# Altium project touch_key.PrjPcb
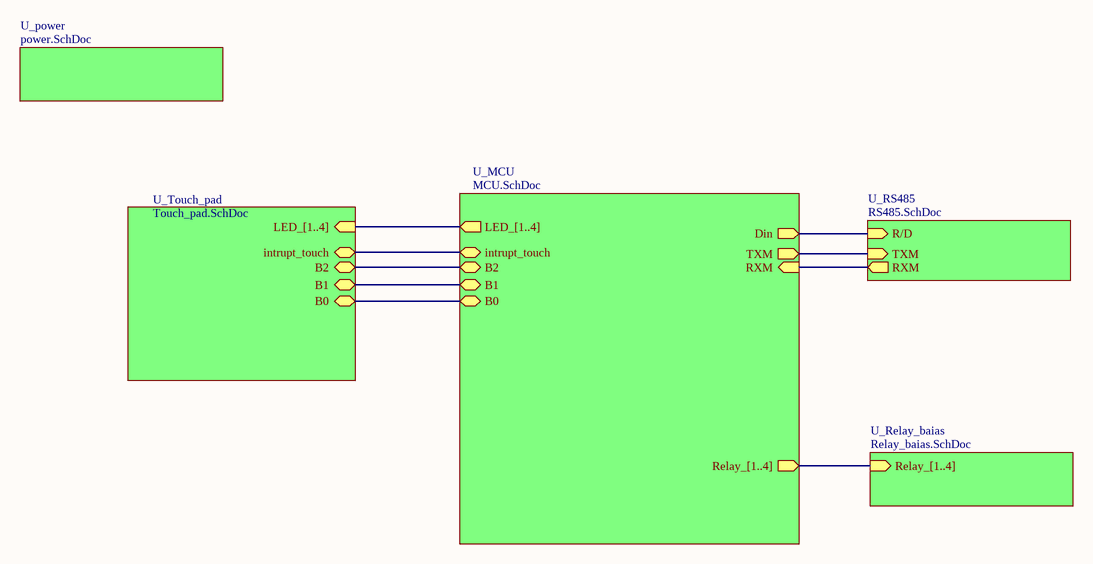
[diagram p0: Top.SchDoc]
6 sheets, 60 parts. Net scope: hierarchical (ports join the sheet entries above them; power ports are global).
Board file: touch_key_v0.1.PcbDoc
Sheets:
  Top.SchDoc
    U_MCU = MCU.SchDoc
    U_RS485 = RS485.SchDoc
    U_Touch_pad = Touch_pad.SchDoc
    U_Relay_baias = Relay_baias.SchDoc
    U_power = power.SchDoc

## Sheet Top.SchDoc
size A4; SheetNumber: 1; SheetTotal: 6

### Sub-sheets
U_MCU = MCU.SchDoc: LED_[1..4] (out), Din (out), Relay_[1..4] (out), B1 (bidir), B0 (bidir), B2 (bidir), TXM (out), RXM (in), intrupt_touch (bidir)
U_power = power.SchDoc: no entries
U_Relay_baias = Relay_baias.SchDoc: Relay_[1..4] (in)
U_RS485 = RS485.SchDoc: TXM (in), R/D (in), RXM (out)
U_Touch_pad = Touch_pad.SchDoc: LED_[1..4] (in), B2 (bidir), B0 (bidir), B1 (bidir), intrupt_touch (bidir)

### Nets
B0: sheet U_MCU/B0, sheet U_Touch_pad/B0
B1: sheet U_MCU/B1, sheet U_Touch_pad/B1
B2: sheet U_MCU/B2, sheet U_Touch_pad/B2
Din: sheet U_MCU/Din, sheet U_RS485/R/D
intrupt_touch: sheet U_MCU/intrupt_touch, sheet U_Touch_pad/intrupt_touch
RX: sheet U_MCU/RXM, sheet U_RS485/RXM
TX: sheet U_MCU/TXM, sheet U_RS485/TXM

### Buses and harness runs
bus sheet U_MCU/LED_[1..4] = sheet U_Touch_pad/LED_[1..4]
bus sheet U_MCU/Relay_[1..4] = sheet U_Relay_baias/Relay_[1..4]

## Sheet MCU.SchDoc
size A4; SheetNumber: 2; SheetTotal: 6
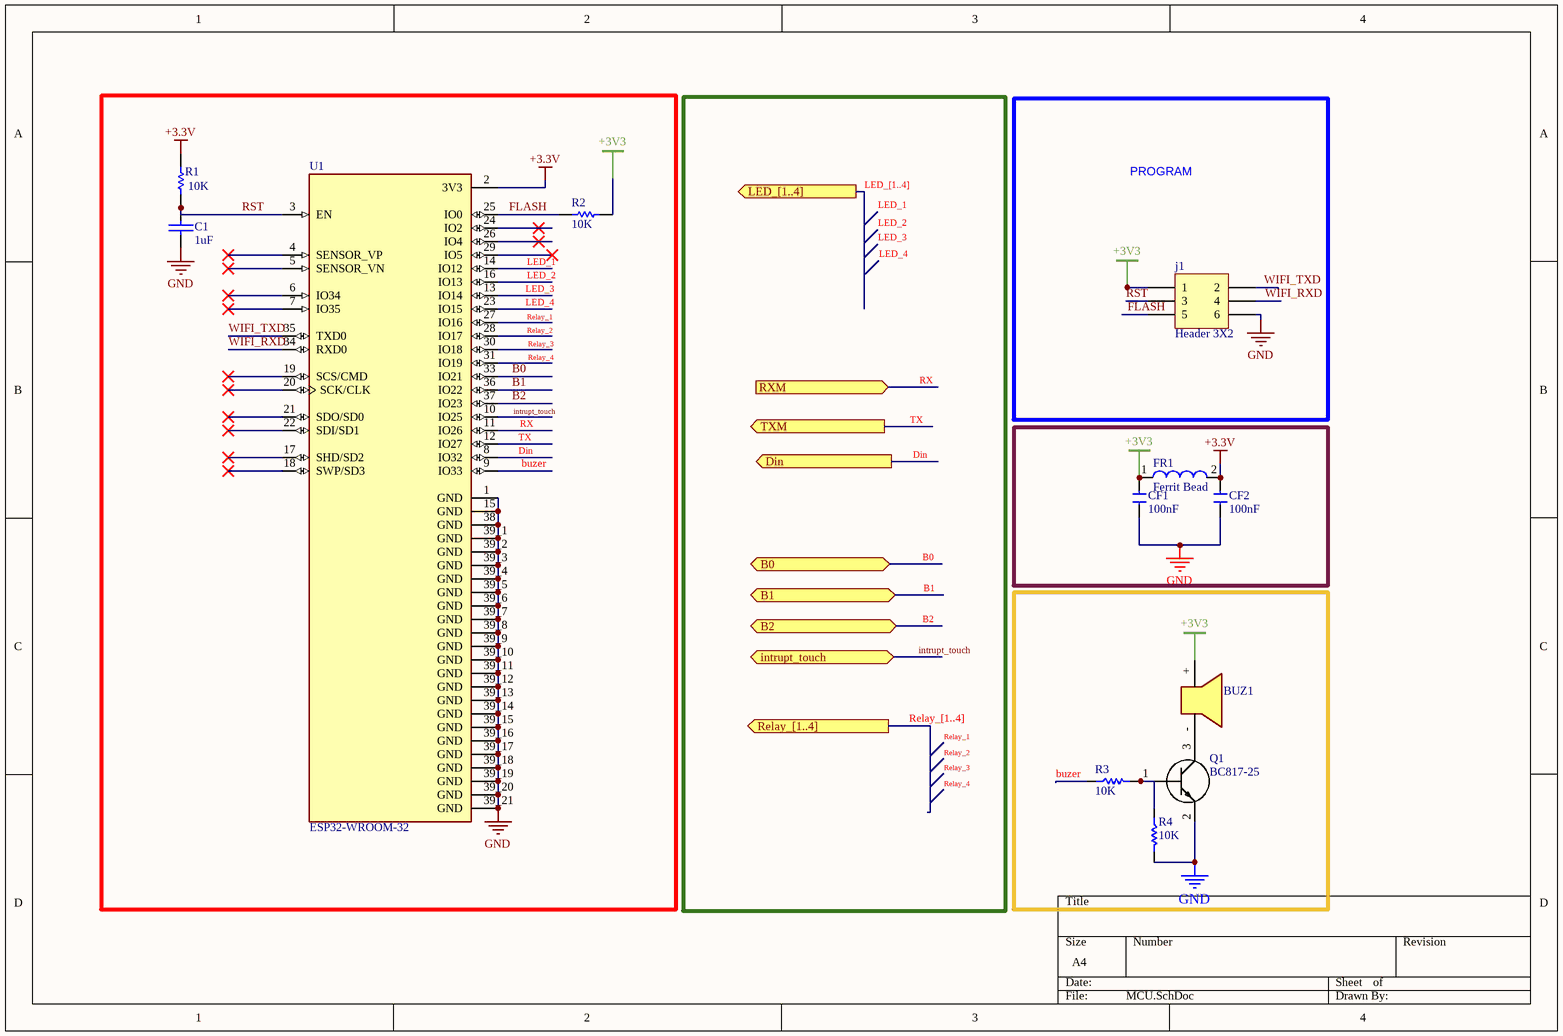
[diagram p1: MCU.SchDoc]

### Parts
(Parts that share a designator on the sheet are numbered #1, #2 ... from top to bottom, then left to right.)
BUZ1  Buzzer  [Buzzer_japan]  (value not drawn)
C1  1uF  [RES 0603 (1608X06L)]
CF1  Capacitor SMD  [RES 0603 (1608X06L)]  (value not drawn)
CF2  Capacitor SMD  [RES 0603 (1608X06L)]  (value not drawn)
FR1  Ferrit Bead  [RES 0805 (2012X06L)]
j1#1  Header 3X2  [HDR2X3]
Q1  BC817-25  [BC81725215]
R1  10K  [RES 0603 (1608X06L)]
R2  10K  [RES 0603 (1608X06L)]
R3  10K  [RES 0603 (1608X06L)]
R4  10K  [RES 0603 (1608X06L)]
U1  ESP32-WROOM-32  [MODULE_ESP32-WROOM-32]

### Blocks framed on the sheet
PROGRAM: j1#1

### Ports
B0 (bidir), B1 (bidir), B2 (bidir), Din (out), intrupt_touch (bidir), LED_[1..4] (out), Relay_[1..4] (out), RXM (in), TXM (out)

### Nets
+3.3V: CF2.1 FR1.2 R1.2 U1.2(3V3)
+3V3: BUZ1.+ CF1.1 FR1.1 j1#1.1 R2.1
GND: C1.1 CF1.2 CF2.2 j1#1.6 Q1.2(E) R4.2 U1.1(GND) U1.15(GND) U1.38(GND) U1.39_1(GND) U1.39_2(GND) U1.39_3(GND) U1.39_4(GND) U1.39_5(GND) U1.39_6(GND) U1.39_7(GND) U1.39_8(GND) U1.39_9(GND) U1.39_10(GND) U1.39_11(GND) U1.39_12(GND) U1.39_13(GND) U1.39_14(GND) U1.39_15(GND) U1.39_16(GND) U1.39_17(GND) U1.39_18(GND) U1.39_19(GND) U1.39_20(GND) U1.39_21(GND)
B0: U1.33(IO21) ; port B0
B1: U1.36(IO22) ; port B1
B2: U1.37(IO23) ; port B2
buzer: R3.1 U1.9(IO33)
Din: U1.8(IO32) ; port Din
FLASH: j1#1.5 R2.2 U1.25(IO0)
intrupt_touch: U1.10(IO25) ; port intrupt_touch
LED_1: U1.14(IO12)
LED_2: U1.16(IO13)
LED_3: U1.13(IO14)
LED_4: U1.23(IO15)
Relay_1: U1.27(IO16)
Relay_2: U1.28(IO17)
Relay_3: U1.30(IO18)
Relay_4: U1.31(IO19)
RST: C1.2 j1#1.3 R1.1 U1.3(EN)
RX: U1.11(IO26) ; port RXM
TX: U1.12(IO27) ; port TXM
WIFI_RXD: j1#1.4 U1.34(RXD0)
WIFI_TXD: j1#1.2 U1.35(TXD0)
NetBUZ1_-: BUZ1.- Q1.3(C)
NetQ1_1: Q1.1(B) R3.2 R4.1

Not connected (* = marked no-connect by the designer): U1 4(SENSOR_VP)* 5(SENSOR_VN)* 6(IO34)* 7(IO35)* 17(SHD/SD2)* 18(SWP/SD3)* 19(SCS/CMD)* 20(SCK/CLK)* 21(SDO/SD0)* 22(SDI/SD1)* 24(IO2)* 26(IO4)* 29(IO5)*

### Buses and harness runs
bus LED_[1..4] = port LED_[1..4]
bus Relay_[1..4] = port Relay_[1..4]

### Notes on the sheet
- Labels drawn without touching a wire or pin: LED_1, LED_2, LED_3, LED_4, Relay_1, Relay_2, Relay_3, Relay_4
- (in symbol Capacitor SMD) 100nF

### Library data of the parts
BUZ1 = Buzzer..: Buzzer/dip/12v; pin to pad: +>1 ->2; LatestRevisionDate: 17-Jul-2002; LatestRevisionNote: Re-released for DXP Platform.; Publisher: Altium Limited
C1 = CAP: Capacitor; Value: 1uF
j1#1 = Header 3X2: Header, 3-Pin, Dual row; LatestRevisionDate: 17-Jul-2002; LatestRevisionNote: Re-released for DXP Platform.; Publisher: Altium Limited
Q1 = BC817-25: Transistor BJT NPN; Manufacturer_Name: Nexperia; Datasheet Link: https://assets.nexperia.com/documents/data-sheet/BC817_BC817W_BC337.pdf; Height: 1.1mm; Manufacturer_Part_Number: BC817-25; Mouser Part Number: N/A; Mouser Price/Stock: https://www.mouser.com/Search/Refine.aspx?Keyword=N%2FA
R1 R2 = Res1: Resistor; Published: 8-Jun-2000; LatestRevisionDate: 17-Jul-2002; LatestRevisionNote: Re-released for DXP Platform.; PackageReference: AXIAL-0.3; Publisher: Altium Limited; Value: 10K
R3 R4 = Resistor: Tolerance: 5%; Power: 1/8 W; Value: 10K
U1 = ESP32-WROOM-32: Bluetooth, WiFi Transceiver Module 2.4GHz ~ 2.5GHz Surface Mount; MF: Espressif Systems; Package: Module Espressif Systems; Digi-Key_Part_Number: 1904-1010-1-ND; Digi-Key_Purchase_URL: https://www.digikey.com/product-detail/en/espressif-systems/ESP32-WROOM-32/1904-1010-1-ND/8544305?utm_source=snapeda&utm_medium=aggregator&utm_campaign=symbol; Value: *; MP: ESP32-WROOM-32; SnapEDA_Link: https://www.snapeda.com/parts/ESP32-WROOM-32/Espressif%20Systems/view-part/2753322/?ref=snap

## Sheet RS485.SchDoc
size A4; SheetNumber: 4; SheetTotal: 6
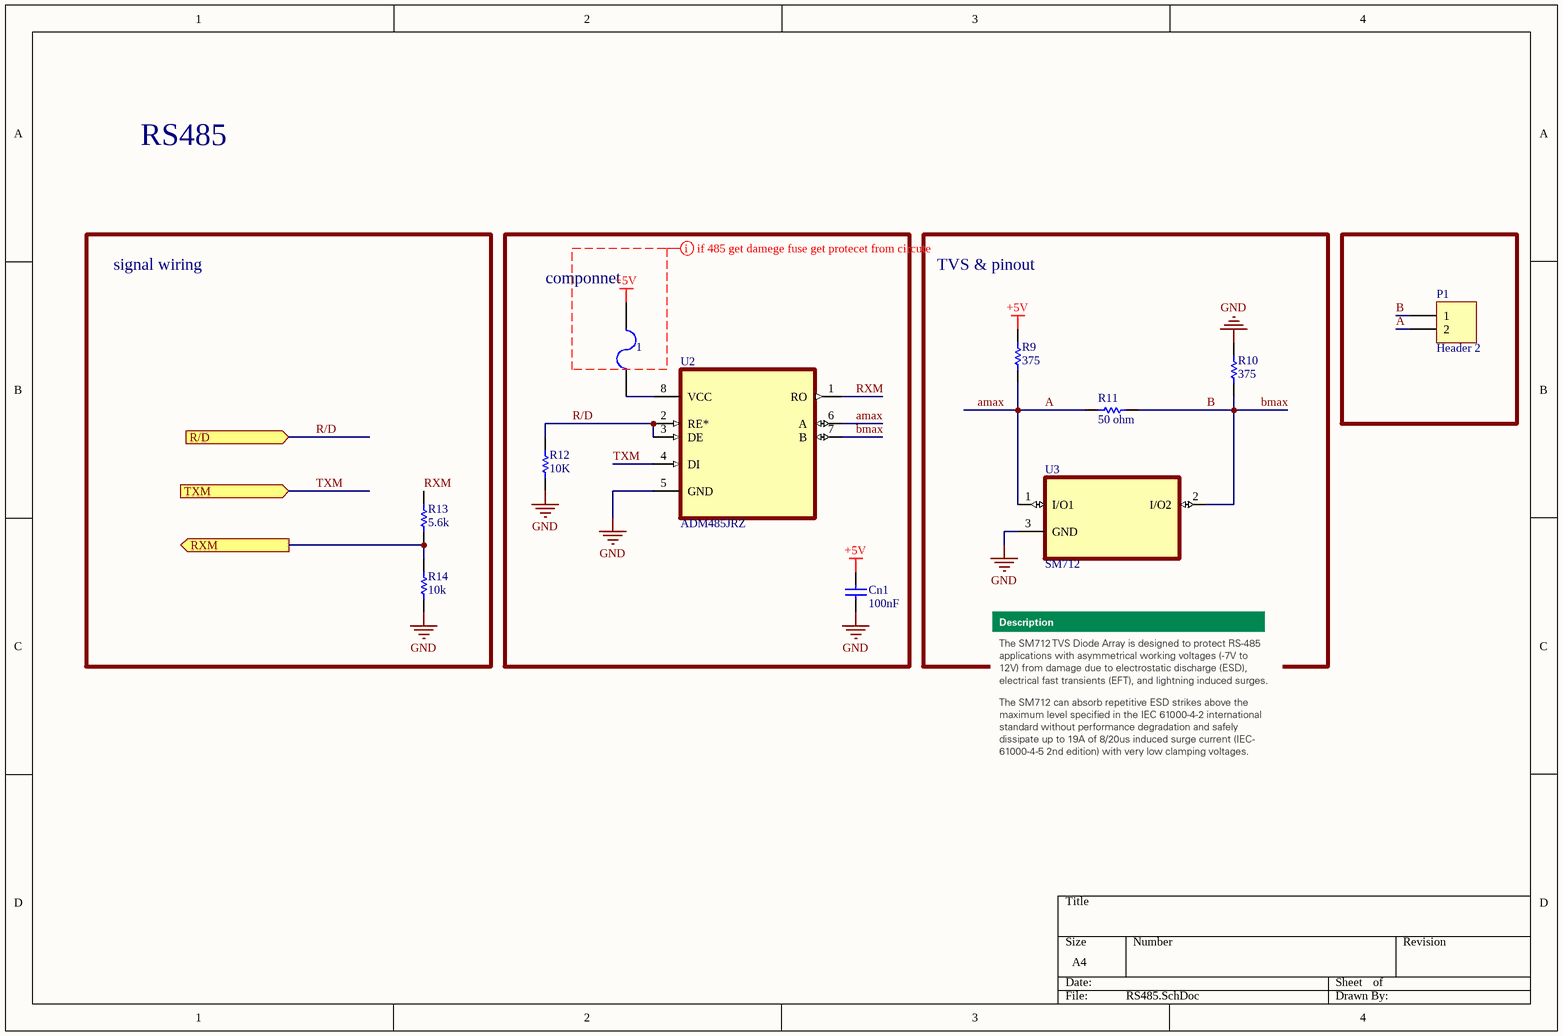
[diagram p2: RS485.SchDoc]

### Parts
1  F=1.0 A  [SMD_RES_0805]  (value not drawn)
Cn1  100nF  [RES 0603 (1608X06L)]
P1  Header 2  [HDR1X2]
R9  375  [RES 0603 (1608X06L)]
R10  375  [RES 0603 (1608X06L)]
R11  50 ohm  [RES 0603 (1608X06L)]
R12  10K  [RES 0603 (1608X06L)]
R13  5.6k  [RES 0603 (1608X06L)]
R14  10k  [RES 0603 (1608X06L)]
U2  ADM485JRZ  [SOIC127P600X175-8N]
U3  SM712  [SOT95P237X112-3N]

### Blocks framed on the sheet
signal wiring: R13 R14
componnet: 1 Cn1 R12 U2
TVS & pinout: R9-R11 U3

### Ports
R/D (in), RXM (out), TXM (in)

### Nets
+5V: 1.2 Cn1.2 R9.1
GND: Cn1.1 R10.1 R12.2 R14.2 U2.5(GND) U3.3(GND)
A: P1.2 R9.2 R11.1 U2.6(A) U3.1(I/O1)  [also labelled amax]
B: P1.1 R10.2 R11.2 U2.7(B) U3.2(I/O2)  [also labelled bmax]
R/D: R12.1 U2.2(RE*) U2.3(DE) ; port R/D  [project net Din]
RX: R13.2 R14.1 ; port RXM
RXM: R13.1 U2.1(RO)
TXM: U2.4(DI) ; port TXM  [project net TX]
Net1_1: 1.1 U2.8(VCC)

### Layout directives
mark named if 485 get damege fuse get protecet from circute: +5V

### Notes on the sheet
- RS485

### Library data of the parts
1 = Fuse SMD1206: SMD Fuses 1206; Designer: Abbas Basereh; Desc.: SMD Fuses 1206; Data: 16-12-2016
Cn1 = CAP SMD PACKAGE: TOTAL CAPACITOR SMD PACK; Designer: Abbas Basereh; Desc.: CAP SMD TOTAL PACKAGES; Data: 2017-3-10; VALUE: 100nF
P1 = Header 2: Header, 2-Pin; LatestRevisionDate: 17-Jul-2002; LatestRevisionNote: Re-released for DXP Platform.; Publisher: Altium Limited
R9-R14 = RES 0805 0.125W: RES 0805; Designer: Abbas Basereh; Desc.: RES SMD 0805; Data: 16-12-2016
U2 = ADM485JRZ: EIA RS-485 Transceiver; MF: {'manufacturer': u'Analog Devices'}; Price: None; Package: None; Availability: Unavailable; Value: *; MP: ADM485JRZ
U3 = SM712: TVS Diode; MF: {'manufacturer': u'Semtech'}; Availability: Unavailable; Value: *; Price: None; MP: SM712; Package: None

## Sheet Touch_pad.SchDoc
size A4; SheetNumber: 3; SheetTotal: 6
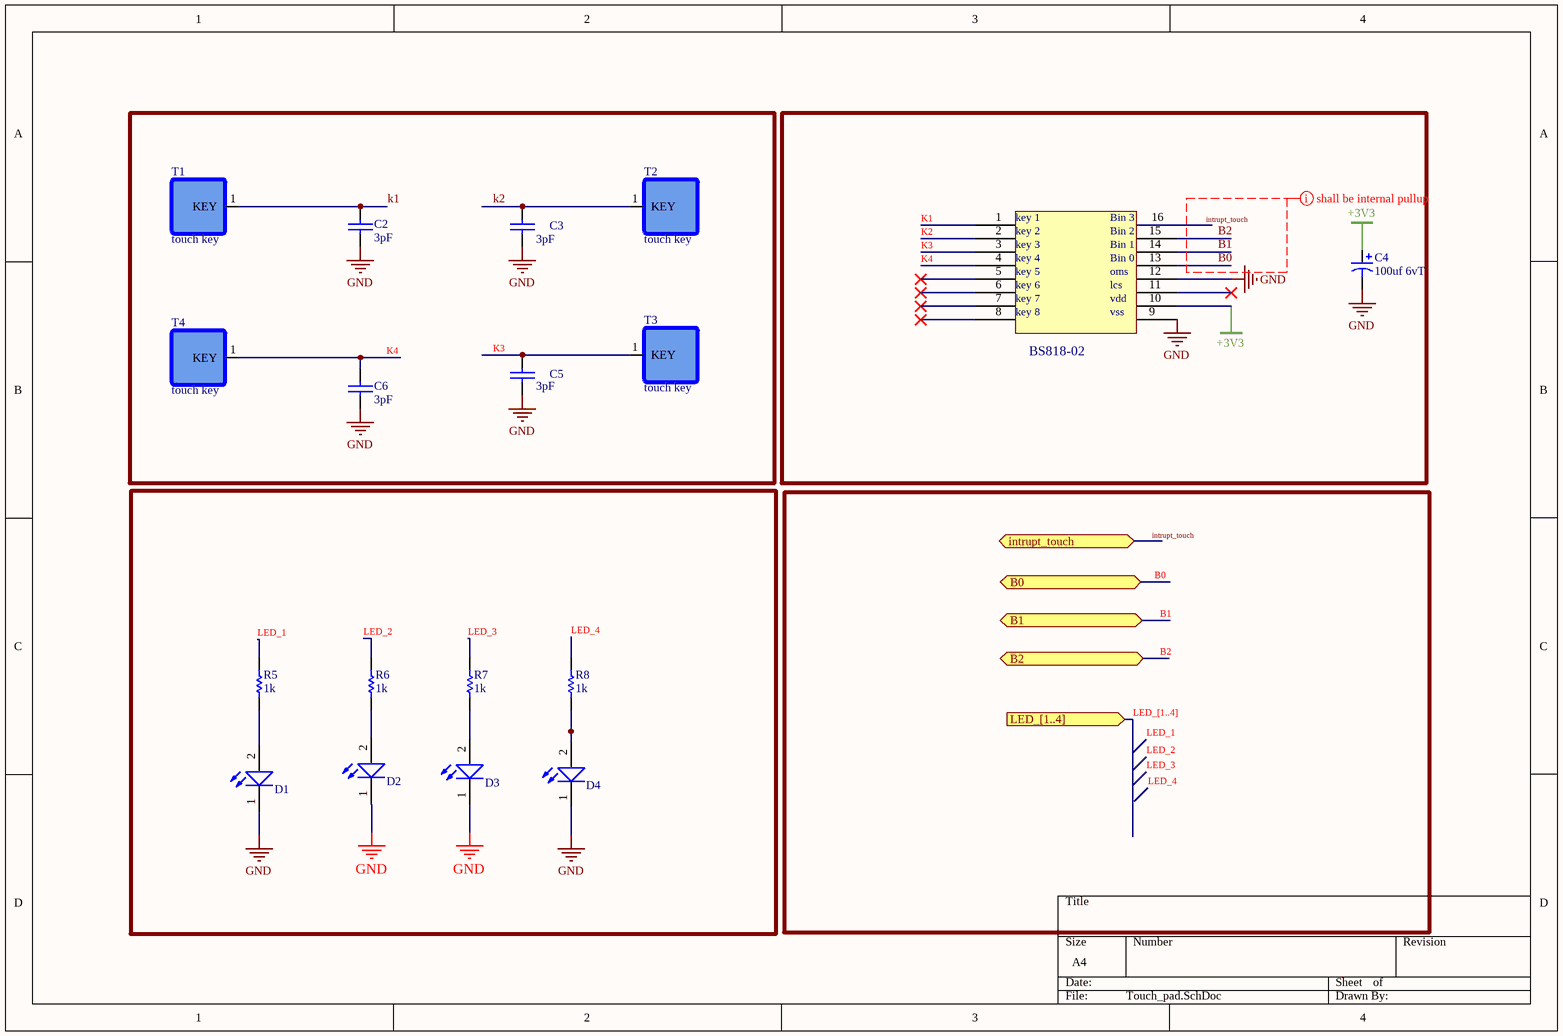
[diagram p3: Touch_pad.SchDoc]

### Parts
BS1  BS818-02  [SOIC127P600X175-16N]  (value not drawn)
C2  3pF  [RES 0603 (1608X06L)]
C3  3pF  [RES 0603 (1608X06L)]
C4  100uf 6vT  [B]
C5  3pF  [RES 0603 (1608X06L)]
C6  3pF  [RES 0603 (1608X06L)]
D1  LED SMD PACKAGE  [LED_SMD_0805]  (value not drawn)
D2  LED SMD PACKAGE  [LED_SMD_0805]  (value not drawn)
D3  LED SMD PACKAGE  [LED_SMD_0805]  (value not drawn)
D4  LED SMD PACKAGE  [LED_SMD_0805]  (value not drawn)
R5  1k  [RES 0603 (1608X06L)]
R6  1k  [RES 0603 (1608X06L)]
R7  1k  [RES 0603 (1608X06L)]
R8  1k  [RES 0603 (1608X06L)]
T1  touch key  [Touch_key]
T2  touch key  [Touch_key]
T3  touch key  [Touch_key]
T4  touch key  [Touch_key]

### Ports
B0 (bidir), B1 (bidir), B2 (bidir), intrupt_touch (bidir), LED_[1..4] (in)

### Nets
+3V3: BS1.10 C4.1
GND: BS1.9 BS1.12 C2.1 C3.1 C4.2 C5.1 C6.1 D1.1(K) D2.1(K) D3.1(K) D4.1(K)
B0: BS1.13 ; port B0
B1: BS1.14 ; port B1
B2: BS1.15 ; port B2
intrupt_touch: BS1.16 ; port intrupt_touch
k1: BS1.1 C2.2 T1.1(KEY)
K2: BS1.2 C3.2 T2.1(KEY)
K3: BS1.3 C5.2 T3.1(KEY)
K4: BS1.4 C6.2 T4.1(KEY)
LED_1: R5.1
LED_2: R6.1
LED_3: R7.1
LED_4: R8.1
NetD1_2: D1.2(A) R5.2
NetD2_2: D2.2(A) R6.2
NetD3_2: D3.2(A) R7.2
NetD4_2: D4.2(A) R8.2

Not connected (* = marked no-connect by the designer): BS1 5* 6* 7* 8* 11*

### Buses and harness runs
bus LED_[1..4] = port LED_[1..4]

### Layout directives
mark named shall be internal pullup: B0, B1, B2, intrupt_touch

### Notes on the sheet
- Labels drawn without touching a wire or pin: LED_1, LED_2, LED_3, LED_4
- (in symbol Component_1) key 1; Bin 3; key 2; Bin 2; key 3; Bin 1; key 4; Bin 0; key 5; oms; key 6; lcs; key 7; vdd; key 8; vss

### Library data of the parts
BS1 = Component_1
C2 C3 C5 C6 = CAP: Capacitor; Value: 3pF
C4 = T494B: Cap/Tantalum/SMD/B; Published: 17-Jul-2002; LatestRevisionDate: 19-Mar-2004; LatestRevisionNote: Silkscreen dimensions re-sized.; DatasheetDocument: Mar-2001; PackageDocument: Mar-2001; PackageReference: B; Publisher: Altium Limited; Code_JEITA: 3528-21; ComponentLink1Description: Manufacturer Link; ComponentLink1URL: http://www.kemet.com/; ComponentLink2Description: Datasheet; ComponentLink2URL: http://www.kemet.com/kemet/web/homepage/kechome.nsf/vapubfilesname/F3102TA.pdf/$file/F3102TA.pdf
D1-D4 = LED SMD PACKAGE: SMD Mono-color Chip LED Waterclear; Part Number: 150080BS75000; Peak Wavelength: 465 nm; Forward Voltage: 3.2 V; Published Date: Jan 2017; Publisher: Ali Hafizi
R5-R8 = Res1: Resistor; Published: 8-Jun-2000; LatestRevisionDate: 17-Jul-2002; LatestRevisionNote: Re-released for DXP Platform.; PackageReference: AXIAL-0.3; Publisher: Altium Limited; Value: 1k

## Sheet Relay_baias.SchDoc
size A; SheetNumber: 6; SheetTotal: 6
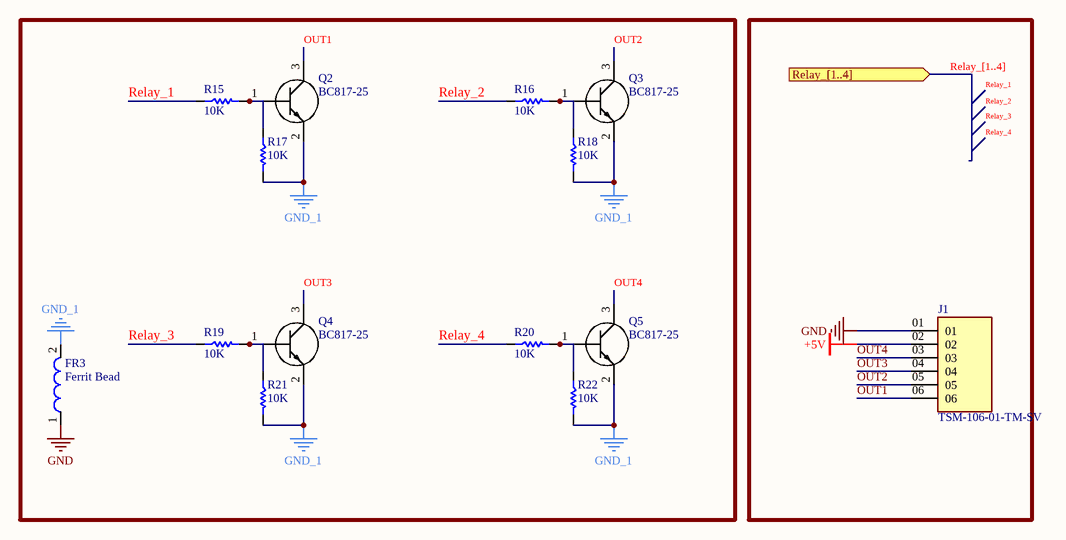
[diagram p4: Relay_baias.SchDoc]

### Parts
(Parts that share a designator on the sheet are numbered #1, #2 ... from top to bottom, then left to right.)
FR3  Ferrit Bead  [RES 0805 (2012X06L)]
J1#2  TSM-106-01-TM-SV  [SAMTEC_TSM-106-01-TM-SV]
Q2  BC817-25  [BC81725215]
Q3  BC817-25  [BC81725215]
Q4  BC817-25  [BC81725215]
Q5  BC817-25  [BC81725215]
R15  10K  [RES 0603 (1608X06L)]
R16  10K  [RES 0603 (1608X06L)]
R17  10K  [RES 0603 (1608X06L)]
R18  10K  [RES 0603 (1608X06L)]
R19  10K  [RES 0603 (1608X06L)]
R20  10K  [RES 0603 (1608X06L)]
R21  10K  [RES 0603 (1608X06L)]
R22  10K  [RES 0603 (1608X06L)]

### Ports
Relay_[1..4] (in)

### Nets
+5V: J1#2.02
GND: FR3.1 J1#2.01
GND_1: FR3.2 Q2.2(E) Q3.2(E) Q4.2(E) Q5.2(E) R17.2 R18.2 R21.2 R22.2
OUT1: J1#2.06 Q2.3(C)
OUT2: J1#2.05 Q3.3(C)
OUT3: J1#2.04 Q4.3(C)
OUT4: J1#2.03 Q5.3(C)
Relay_1: R15.1
Relay_2: R16.1
Relay_3: R19.1
Relay_4: R20.1
NetQ2_1: Q2.1(B) R15.2 R17.1
NetQ3_1: Q3.1(B) R16.2 R18.1
NetQ4_1: Q4.1(B) R19.2 R21.1
NetQ5_1: Q5.1(B) R20.2 R22.1

### Buses and harness runs
bus Relay_[1..4] = port Relay_[1..4]

### Notes on the sheet
- Labels drawn without touching a wire or pin: Relay_1, Relay_2, Relay_3, Relay_4

### Library data of the parts
J1#2 = TSM-106-01-TM-SV: CONN HEADER SMD 6POS 2.54MM; MF: Samtec; SnapEDA_Link: https://www.snapeda.com/parts/TSM-106-01-TM-SV/Samtec/view-part/3383178/?ref=snap; Check_prices: https://www.snapeda.com/parts/TSM-106-01-TM-SV/Samtec/view-part/3383178/?ref=eda; Availability: Bad; Value: *; Price: None; MP: TSM-106-01-TM-SV; Package: None; Purchase-URL: https://pricing.snapeda.com/search/part/TSM-106-01-TM-SV/?ref=eda
Q2-Q5 = BC817-25: as Q1 on sheet MCU; Datasheet Link: https://assets.nexperia.com/documents/data-sheet/BC817_BC817W_BC337.pdf; Height: 1.1mm; Manufacturer_Part_Number: BC817-25; Mouser Part Number: N/A; Mouser Price/Stock: https://www.mouser.com/Search/Refine.aspx?Keyword=N%2FA
R15-R22 = Resistor: Tolerance: 5%; Power: 1/8 W; Value: 10K

## Sheet power.SchDoc
size A; SheetNumber: 5; SheetTotal: 6
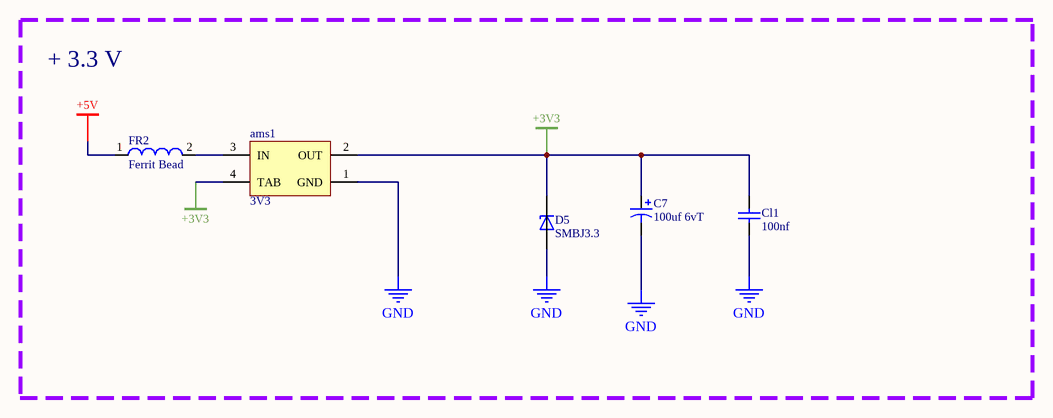
[diagram p5: power.SchDoc]

### Parts
ams1  3V3  [SOT223]
C7  100uf 6vT  [B]
Cl1  100nf  [RES 0603 (1608X06L)]
D5  SMBJ3.3  [DIOM4336X265N]
FR2  Ferrit Bead  [RES 0805 (2012X06L)]

### Blocks framed on the sheet
+ 3.3 V: ams1 C7 Cl1 D5 FR2

### Nets
+3V3: ams1.2(OUT) ams1.4(TAB) C7.1 Cl1.2 D5.C
+5V: FR2.1
GND: ams1.1(GND) C7.2 Cl1.1 D5.A
Netams1_3: ams1.3(IN) FR2.2

### Library data of the parts
ams1 = AMS1117-x.x: x.x Volt, 800mA Low-Dropout Linear Regulator, 4-pin SOT-223; Designer: Ali Hafizi; Data: 16-12-2016
C7 = T494B: Cap/Tantalum/SMD/B; Published: 17-Jul-2002; LatestRevisionDate: 19-Mar-2004; LatestRevisionNote: Silkscreen dimensions re-sized.; DatasheetDocument: Mar-2001; PackageDocument: Mar-2001; PackageReference: B; Publisher: Altium Limited; Code_JEITA: 3528-21; ComponentLink1Description: Manufacturer Link; ComponentLink1URL: http://www.kemet.com/; ComponentLink2Description: Datasheet; ComponentLink2URL: http://www.kemet.com/kemet/web/homepage/kechome.nsf/vapubfilesname/F3102TA.pdf/$file/F3102TA.pdf
Cl1 = CAP SMD 0805: CAP 0805; Designer: Abbas Basereh; Desc.: CAP SMD 0805; Data: 16-12-2016
D5 = SMBJ33: MF: {'manufacturer': u'Taiwan Semiconductor'}; Price: None; Availability: Unavailable; Value: *; MP: SMBJ33; Package: None

## Nets that join several sheets
+3V3: MCU (5 pins), Touch_pad (BS1.10 C4.1), power (5 pins)
+5V: RS485 (1.2 Cn1.2 R9.1), Relay_baias (J1#2.02), power (FR2.1)
GND: MCU (30 pins), RS485 (6 pins), Touch_pad (11 pins), Relay_baias (FR3.1 J1#2.01), power (ams1.1 C7.2 Cl1.1 D5.A)
B0: MCU (U1.33), Touch_pad (BS1.13)
B1: MCU (U1.36), Touch_pad (BS1.14)
B2: MCU (U1.37), Touch_pad (BS1.15)
Din: MCU (U1.8), RS485 (R12.1 U2.2 U2.3)
intrupt_touch: MCU (U1.10), Touch_pad (BS1.16)
LED_1: MCU (U1.14), Touch_pad (R5.1)
LED_2: MCU (U1.16), Touch_pad (R6.1)
LED_3: MCU (U1.13), Touch_pad (R7.1)
LED_4: MCU (U1.23), Touch_pad (R8.1)
Relay_1: MCU (U1.27), Relay_baias (R15.1)
Relay_2: MCU (U1.28), Relay_baias (R16.1)
Relay_3: MCU (U1.30), Relay_baias (R19.1)
Relay_4: MCU (U1.31), Relay_baias (R20.1)
RX: MCU (U1.11), RS485 (R13.2 R14.1)
TX: MCU (U1.12), RS485 (U2.4)